# Altium schematic sheet Viper12A_SMPS_12V_2A_V1.SchDoc
size A4; SheetNumber: 1; SheetTotal: 1
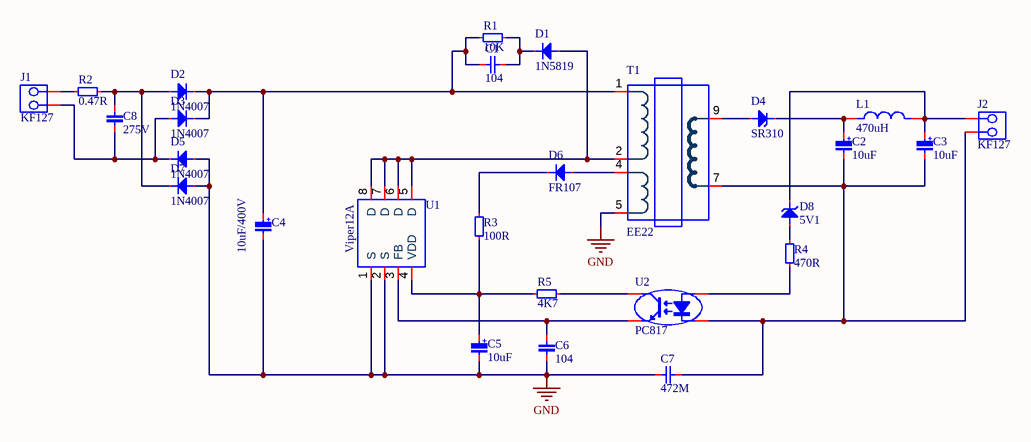
[diagram p0: Viper12A_SMPS_12V_2A_V1.SchDoc]

## Parts
C1  104  [CAP_DISC_4x3_YL]
C2  10uF  [CAP_RAD_3.5mm]
C3  10uF  [CAP_RAD_3.5mm]
C4  10uF/400V  [CAP_RAD_D10x12.5_POL_BK]
C5  10uF  [CAP_RAD_2.5mm]
C6  104  [CAP_Ceramic_Disc_2]
C7  472M  [CAP_DISC_Y2222]
C8  275V  [CAP_BOX_13x4x7_BL]
D1  1N5819  [DO-204AL-BK]
D2  1N4007  [DO-204AL-BK]
D3  1N4007  [DO-204AL-BK]
D4  SR310  [DO-201AD-R-BK]
D5  1N4007  [DO-204AL-BK]
D6  FR107  [DO-204AL-BK]
D7  1N4007  [DO-204AL-BK]
D8  5V1  [DO-204AL-RD]
J1  KF127  [DG127-5.0-02P-14-00AH]
J2  KF127  [DG127-5.0-02P-14-00AH]
L1  470uH  [RLB0712_vertical]
R1  10K  [RES-0.5W-H]
R2  0.47R  [RES-0.5W-H]
R3  100R  [RES-0.25W-H]
R4  470R  [RES-0.25W-H]
R5  4K7  [RES-0.25W-H]
T1  EE22  [TRANSFORMER-EE22-VERTICAL(5+5)]
U1  Viper12A  [DIP-8]
U2  PC817  [PC817-DIP]

## Nets
GND: C4.2 C5.2 C6.1 C7.1 D5.1 D7.1 T1.5 U1.1(S) U1.2(S)
NetC1_1: C1.1 C4.1 D2.2 D3.2 R1.2 T1.1
NetC1_2: C1.2 D1.2 R1.1
NetC2_1: C2.1 D4.2 L1.1
NetC2_2: C2.2 C3.2 C7.2 J2.1 T1.7 U2.2(K)
NetC3_1: C3.1 D8.2 J2.2 L1.2
NetC5_1: C5.1 R3.1 R5.2 U1.4(VDD)
NetC6_2: C6.2 U1.3(FB) U2.3(E)
NetC8_1: C8.1 D3.1 D5.2 J1.1
NetC8_2: C8.2 D2.1 D7.2 R2.1
NetD1_1: D1.1 T1.2 U1.5(D) U1.6(D) U1.7(D) U1.8(D)
NetD4_1: D4.1 T1.9
NetD6_1: D6.1 T1.4
NetD6_2: D6.2 R3.2
NetD8_1: D8.1 R4.2
NetJ1_2: J1.2 R2.2
NetR4_1: R4.1 U2.1(A)
NetR5_1: R5.1 U2.4(C)

## Notes on the sheet
- (in symbol Capacitor(Radian)) +

## Library data of the parts
C1 C6 C7 = Capacitors(Disc)
C2-C5 = Capacitor(Radian)
C8 = Capacitors(film)
D1 = Diode-1N5819: 1A - Schotky Diode
D2 D3 D5-D7 = Diode-1N4007
D4 = Diode-SR310: 3A-Schotky
D8 = Diode-Zener
J1 J2 = DG127-5.0-02P-14-00AH
L1 = Inductors
R1-R5 = Resistors THD
T1 = TRANS-EE22-18-6-VERTICAL(5+5)
U1 = SMPS-Viper12A
U2 = Opto-PC817